# Altium schematic sheet Cover.SchDoc
size A3; ApprovedBy: M. Berk Aydoğan; CheckedBy: Udemy; Revision: AA; SheetNumber: 1; SheetTotal: 5; PageSize: A3; ProjectDescription: Wireless Security Detector; PreparedBy: Elif Arslan; TotalSheetSize: 1 / 2
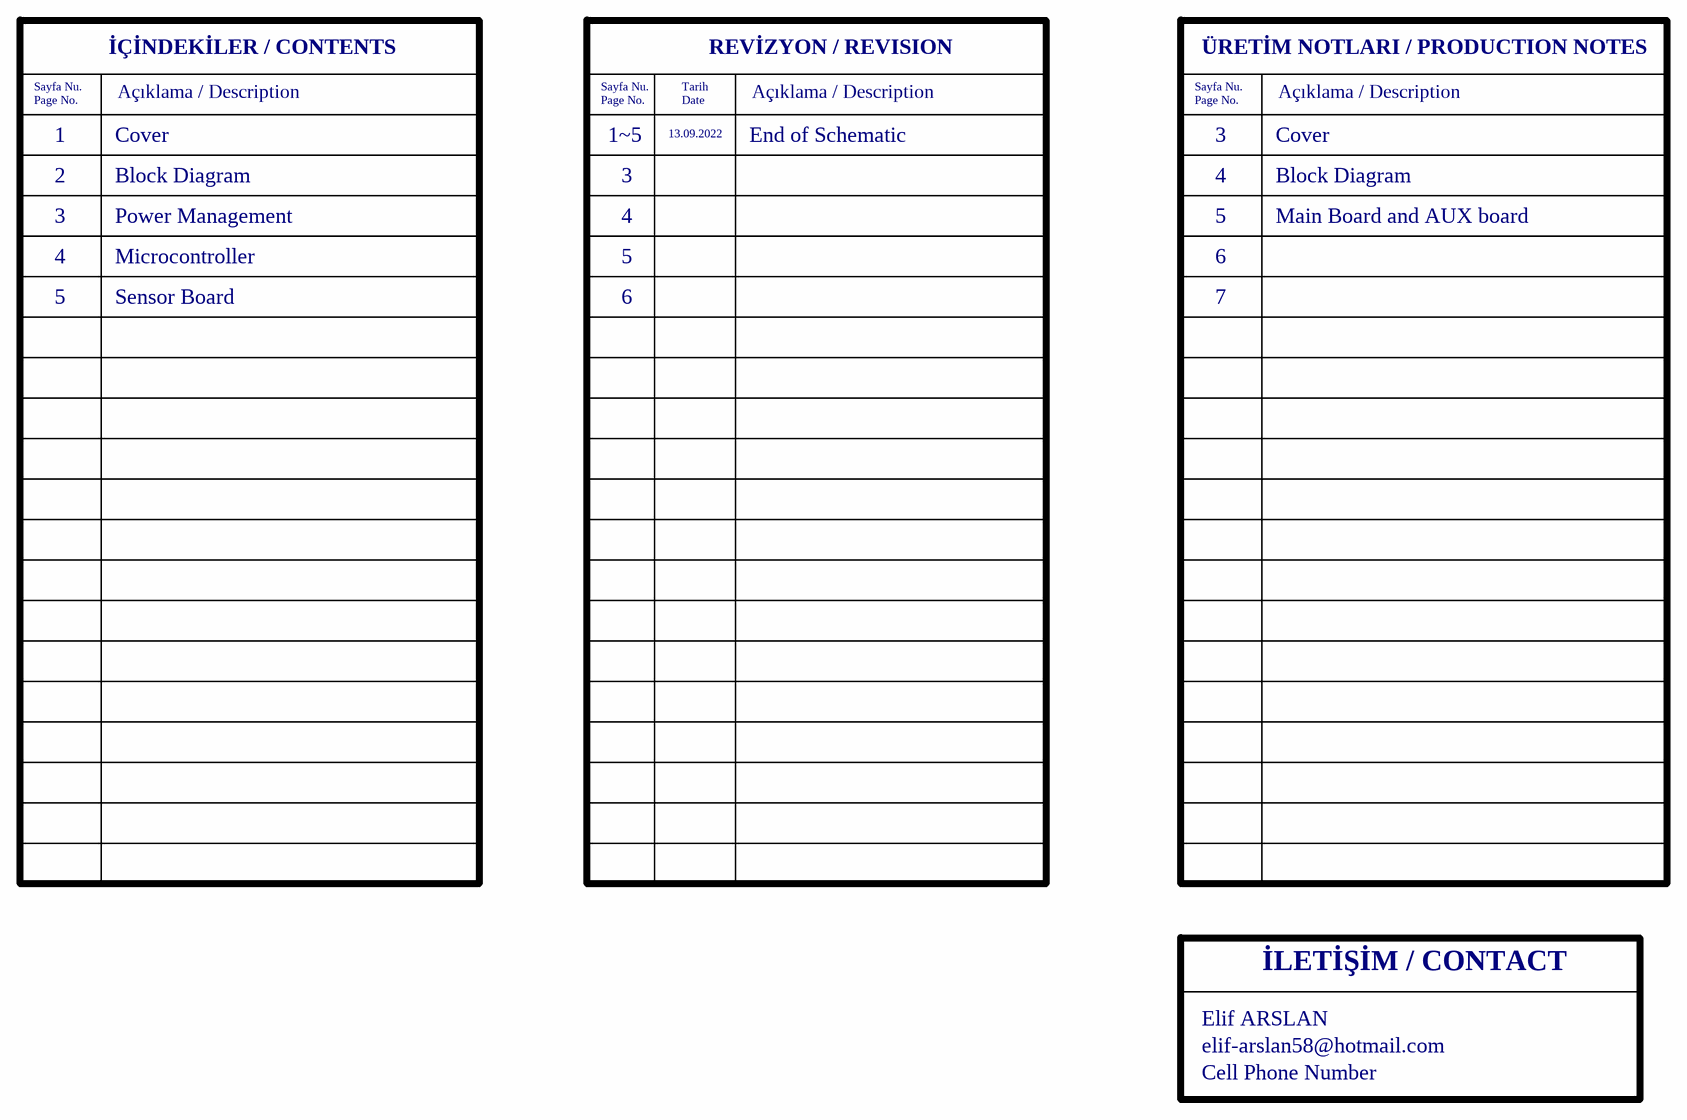
[diagram p0: Cover.SchDoc]

## Notes on the sheet
- Sayfa Nu.
- Page No.
- İÇİNDEKİLER / CONTENTS
- Açıklama / Description
- Tarih
- Date
- REVİZYON / REVISION
- ÜRETİM NOTLARI / PRODUCTION NOTES
- 1
- 2
- Cover
- Block Diagram
- 1~5
- 3
- 13.09.2022
- End of Schematic
- 4
- Power Management
- 5
- Main Board and AUX board
- Microcontroller
- Sensor Board
- 6
- 7
- İLETİŞİM / CONTACT
- Elif ARSLAN
- elif-arslan58@hotmail.com
- Cell Phone Number
- TANIM / DESCRIPTION
- DOSYA ADI / FILE NAME
- HAZIRLAYAN / PREPARED BY
- KONTROL EDEN / CHECKED BY
- YAYIN TARİHİ / REL DATE
- COMPANY NAME
- ONAYLAYAN / APPROVED BY
- ELECTRICAL - ELECTRONICS
- BÖLÜM  DEPARTMENT
- BOYUT / SIZE
- SAYFA / SHEET
- ENGINEERING